# Altium schematic sheet Sheet1.SchDoc
size A3; SheetNumber: 2; SheetTotal: 2
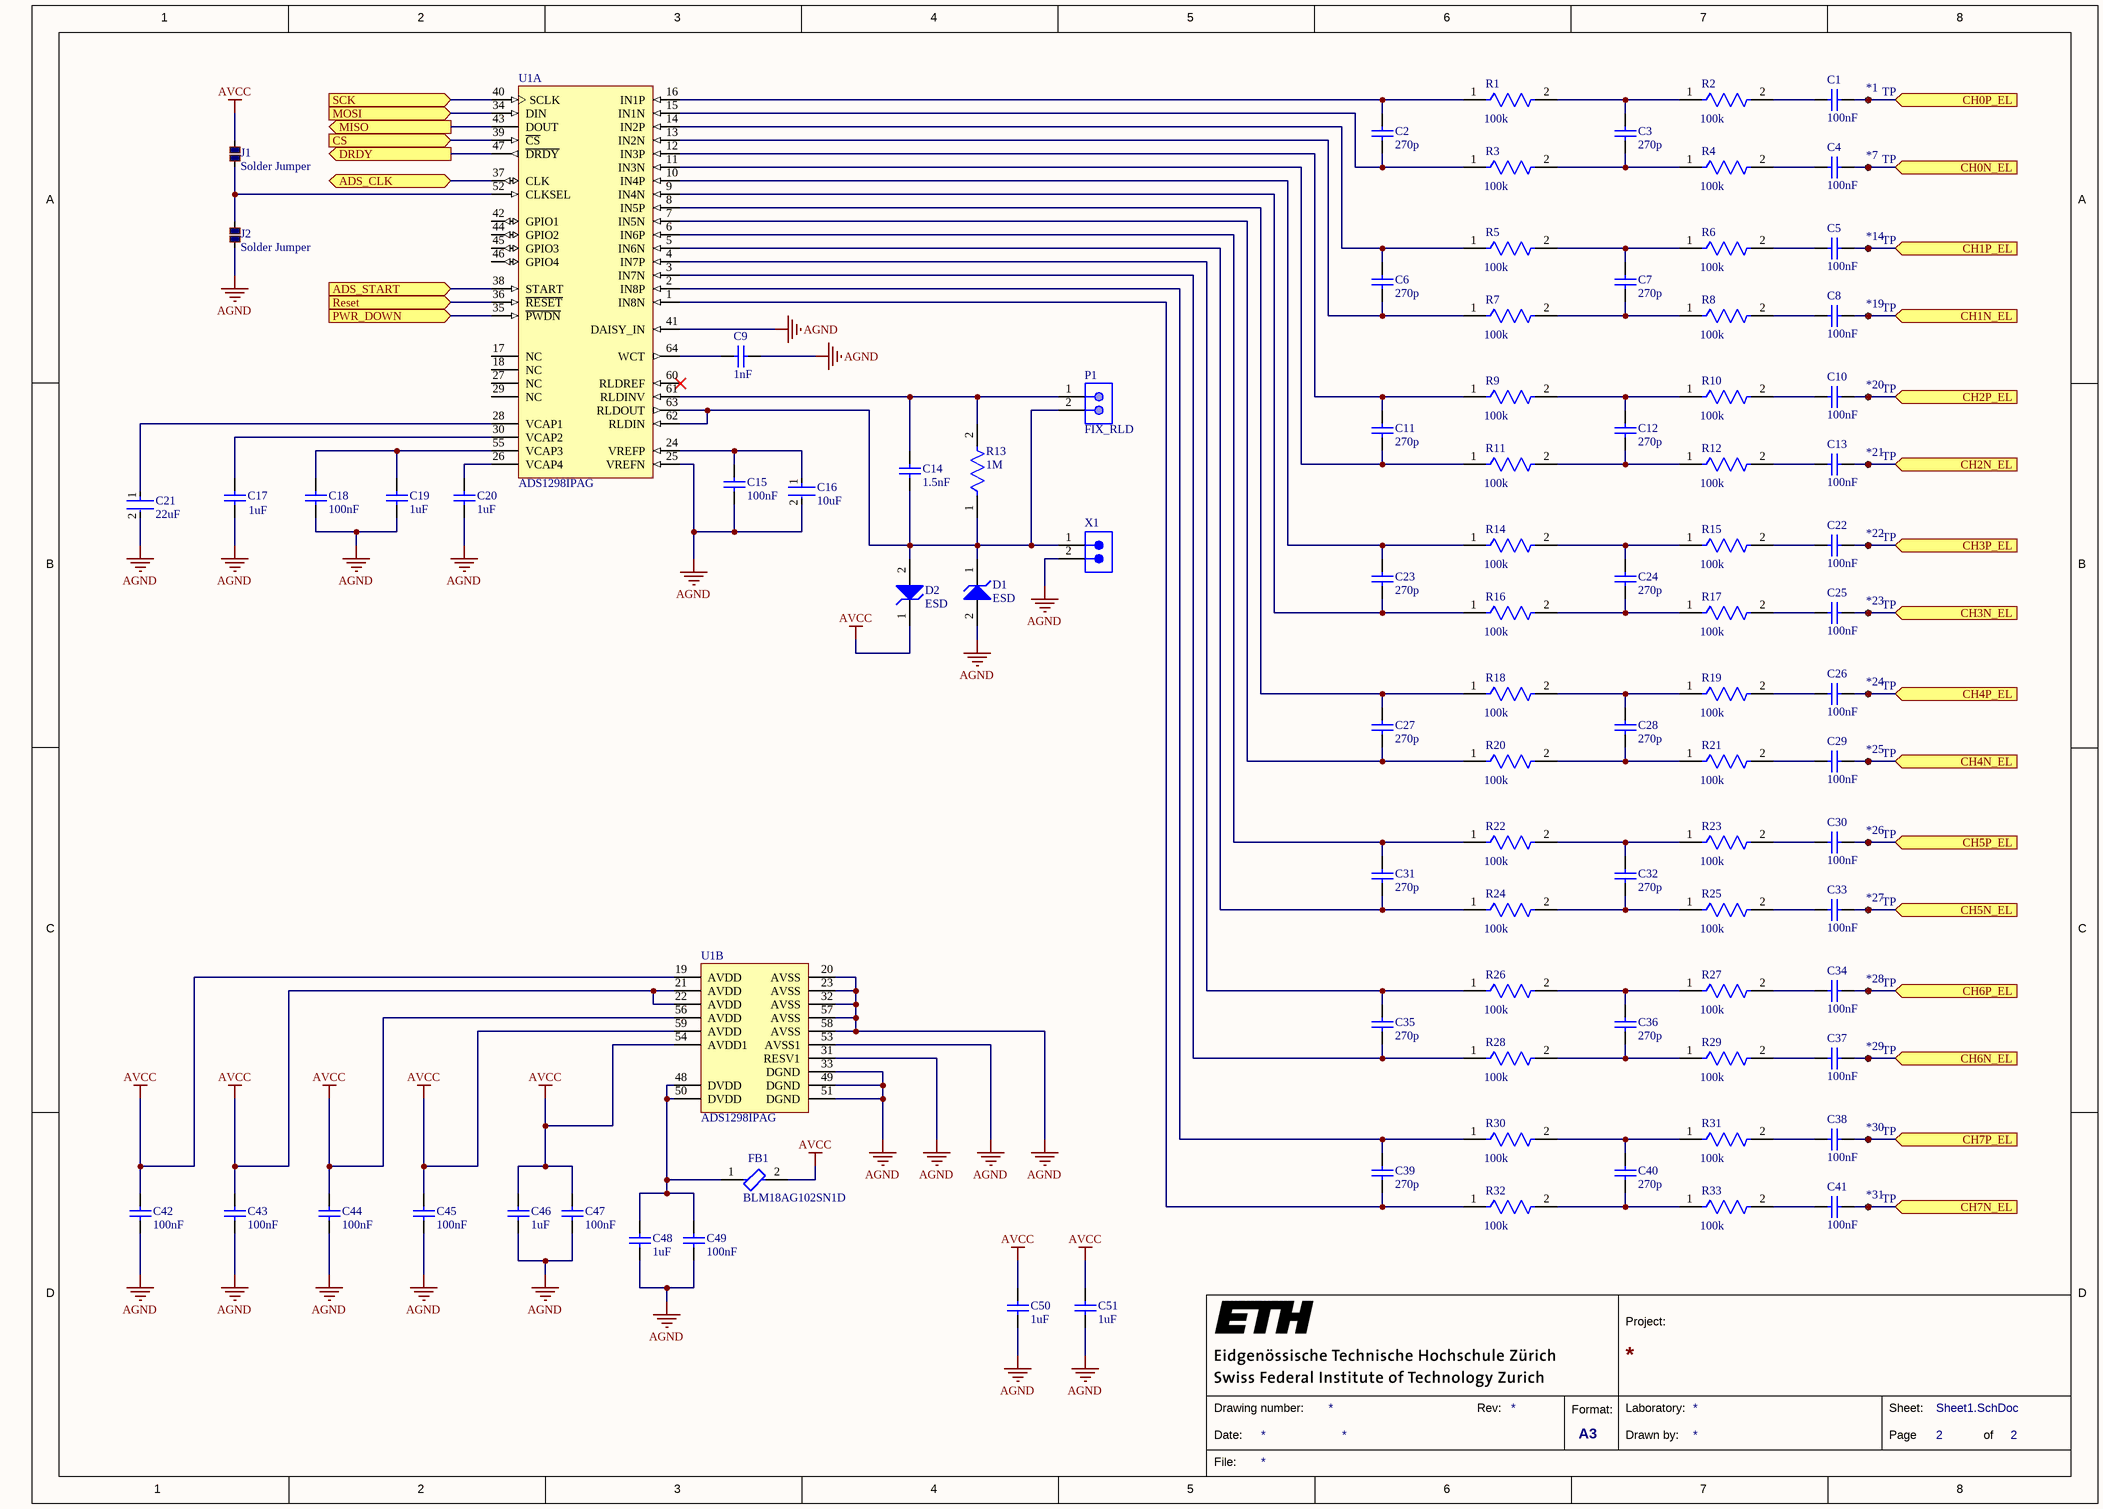
[diagram p0: Sheet1.SchDoc]

## Parts
*1  TP  [Pad-1mm]  (no BOM)
*7  TP  [Pad-1mm]  (no BOM)
*14  TP  [Pad-1mm]  (no BOM)
*19  TP  [Pad-1mm]  (no BOM)
*20  TP  [Pad-1mm]  (no BOM)
*21  TP  [Pad-1mm]  (no BOM)
*22  TP  [Pad-1mm]  (no BOM)
*23  TP  [Pad-1mm]  (no BOM)
*24  TP  [Pad-1mm]  (no BOM)
*25  TP  [Pad-1mm]  (no BOM)
*26  TP  [Pad-1mm]  (no BOM)
*27  TP  [Pad-1mm]  (no BOM)
*28  TP  [Pad-1mm]  (no BOM)
*29  TP  [Pad-1mm]  (no BOM)
*30  TP  [Pad-1mm]  (no BOM)
*31  TP  [Pad-1mm]  (no BOM)
C1  100nF  [CAPC1608X92X38LL15T08]
C2  270p  [CAPC1608X90X35NL10T15]
C3  270p  [CAPC1608X90X35NL10T15]
C4  100nF  [CAPC1608X92X38LL15T08]
C5  100nF  [CAPC1608X92X38LL15T08]
C6  270p  [CAPC1608X90X35NL10T15]
C7  270p  [CAPC1608X90X35NL10T15]
C8  100nF  [CAPC1608X92X38LL15T08]
C9  1nF  [CAPC1608X90X35LL10T15]
C10  100nF  [CAPC1608X92X38LL15T08]
C11  270p  [CAPC1608X90X35NL10T15]
C12  270p  [CAPC1608X90X35NL10T15]
C13  100nF  [CAPC1608X92X38LL15T08]
C14  1.5nF  [CAPC1608X90X35ML10T15]
C15  100nF  [CAPC1608X92X38LL15T08]
C16  10uF  [FP-GRM188-0_1-e0_2_0_55-IPC_B]
C17  1uF  [CAPC1608X95X40ML15T15]
C18  100nF  [CAPC1608X92X38LL15T08]
C19  1uF  [CAPC1608X95X40ML15T15]
C20  1uF  [CAPC1608X95X40ML15T15]
C21  22uF  [FP-CL10-IPC_A]
C22  100nF  [CAPC1608X92X38LL15T08]
C23  270p  [CAPC1608X90X35NL10T15]
C24  270p  [CAPC1608X90X35NL10T15]
C25  100nF  [CAPC1608X92X38LL15T08]
C26  100nF  [CAPC1608X92X38LL15T08]
C27  270p  [CAPC1608X90X35NL10T15]
C28  270p  [CAPC1608X90X35NL10T15]
C29  100nF  [CAPC1608X92X38LL15T08]
C30  100nF  [CAPC1608X92X38LL15T08]
C31  270p  [CAPC1608X90X35NL10T15]
C32  270p  [CAPC1608X90X35NL10T15]
C33  100nF  [CAPC1608X92X38LL15T08]
C34  100nF  [CAPC1608X92X38LL15T08]
C35  270p  [CAPC1608X90X35NL10T15]
C36  270p  [CAPC1608X90X35NL10T15]
C37  100nF  [CAPC1608X92X38LL15T08]
C38  100nF  [CAPC1608X92X38LL15T08]
C39  270p  [CAPC1608X90X35NL10T15]
C40  270p  [CAPC1608X90X35NL10T15]
C41  100nF  [CAPC1608X92X38LL15T08]
C42  100nF  [CAPC1608X92X38LL15T08]
C43  100nF  [CAPC1608X92X38LL15T08]
C44  100nF  [CAPC1608X92X38LL15T08]
C45  100nF  [CAPC1608X92X38LL15T08]
C46  1uF  [CAPC1608X95X40ML15T15]
C47  100nF  [CAPC1608X92X38LL15T08]
C48  1uF  [CAPC1608X95X40ML15T15]
C49  100nF  [CAPC1608X92X38LL15T08]
C50  1uF  [CAPC1608X95X40ML15T15]
C51  1uF  [CAPC1608X95X40ML15T15]
D1  ESD  [DFN110P160X55-2N]
D2  ESD  [DFN110P160X55-2N]
FB1  BLM18AG102SN1D  [FP-BLM18-0_15-t0_8-MFG]
J1  Solder Jumper  [Small Solder Jumper]
J2  Solder Jumper  [Small Solder Jumper]
P1  FIX_RLD  [SMTC-TSW-102-07-S-S]
R1  100k  [FP-CRCW0603-e3-IPC_C]
R2  100k  [FP-CRCW0603-e3-IPC_C]
R3  100k  [FP-CRCW0603-e3-IPC_C]
R4  100k  [FP-CRCW0603-e3-IPC_C]
R5  100k  [FP-CRCW0603-e3-IPC_C]
R6  100k  [FP-CRCW0603-e3-IPC_C]
R7  100k  [FP-CRCW0603-e3-IPC_C]
R8  100k  [FP-CRCW0603-e3-IPC_C]
R9  100k  [FP-CRCW0603-e3-IPC_C]
R10  100k  [FP-CRCW0603-e3-IPC_C]
R11  100k  [FP-CRCW0603-e3-IPC_C]
R12  100k  [FP-CRCW0603-e3-IPC_C]
R13  1M  [FP-CRCW0603-e3-MFG]
R14  100k  [FP-CRCW0603-e3-IPC_C]
R15  100k  [FP-CRCW0603-e3-IPC_C]
R16  100k  [FP-CRCW0603-e3-IPC_C]
R17  100k  [FP-CRCW0603-e3-IPC_C]
R18  100k  [FP-CRCW0603-e3-IPC_C]
R19  100k  [FP-CRCW0603-e3-IPC_C]
R20  100k  [FP-CRCW0603-e3-IPC_C]
R21  100k  [FP-CRCW0603-e3-IPC_C]
R22  100k  [FP-CRCW0603-e3-IPC_C]
R23  100k  [FP-CRCW0603-e3-IPC_C]
R24  100k  [FP-CRCW0603-e3-IPC_C]
R25  100k  [FP-CRCW0603-e3-IPC_C]
R26  100k  [FP-CRCW0603-e3-IPC_C]
R27  100k  [FP-CRCW0603-e3-IPC_C]
R28  100k  [FP-CRCW0603-e3-IPC_C]
R29  100k  [FP-CRCW0603-e3-IPC_C]
R30  100k  [FP-CRCW0603-e3-IPC_C]
R31  100k  [FP-CRCW0603-e3-IPC_C]
R32  100k  [FP-CRCW0603-e3-IPC_C]
R33  100k  [FP-CRCW0603-e3-IPC_C]
U1  ADS1298IPAG  [TI-PAG64_L]  (parts A,B of 2)
X1  43650-0213  [43650-0213]  (value not drawn)

## Ports
ADS_CLK (bidir), ADS_START (in), CH0N_EL (in), CH0P_EL (in), CH1N_EL (in), CH1P_EL (in), CH2N_EL (in), CH2P_EL (in), CH3N_EL (in), CH3P_EL (in), CH4N_EL (in), CH4P_EL (in), CH5N_EL (in), CH5P_EL (in), CH6N_EL (in), CH6P_EL (in), CH7N_EL (in), CH7P_EL (in), CS (in), DRDY (out), MISO (out), MOSI (in), PWR_DOWN (in), Reset (in), SCK (in)

## Nets
AGND: C9.1 C15.1 C16.2 C17.1 C18.2 C19.1 C20.1 C21.2 C42.1 C43.1 C44.1 C45.1 C46.1 C47.1 C48.1 C49.1 C50.1 C51.1 D1.2 J2.1 U1.20(AVSS) U1.23(AVSS) U1.25(VREFN) U1.31(RESV1) U1.32(AVSS) U1.33(DGND) U1.41(DAISY_IN) U1.49(DGND) U1.51(DGND) U1.53(AVSS1) U1.57(AVSS) U1.58(AVSS) X1.2
AVCC: C42.2 C43.2 C44.2 C45.2 C46.2 C47.2 C50.2 C51.2 D2.1 FB1.2 J1.2 U1.19(AVDD) U1.21(AVDD) U1.22(AVDD) U1.54(AVDD1) U1.56(AVDD) U1.59(AVDD)
ADS_CLK: U1.37(CLK) ; port ADS_CLK
ADS_START: U1.38(START) ; port ADS_START
CH0N_EL: *7.1 C4.1 ; port CH0N_EL
CH0P_EL: *1.1 C1.1 ; port CH0P_EL
CH1N_EL: *19.1 C8.1 ; port CH1N_EL
CH1P_EL: *14.1 C5.1 ; port CH1P_EL
CH2N_EL: *21.1 C13.1 ; port CH2N_EL
CH2P_EL: *20.1 C10.1 ; port CH2P_EL
CH3N_EL: *23.1 C25.1 ; port CH3N_EL
CH3P_EL: *22.1 C22.1 ; port CH3P_EL
CH4N_EL: *25.1 C29.1 ; port CH4N_EL
CH4P_EL: *24.1 C26.1 ; port CH4P_EL
CH5N_EL: *27.1 C33.1 ; port CH5N_EL
CH5P_EL: *26.1 C30.1 ; port CH5P_EL
CH6N_EL: *29.1 C37.1 ; port CH6N_EL
CH6P_EL: *28.1 C34.1 ; port CH6P_EL
CH7N_EL: *31.1 C41.1 ; port CH7N_EL
CH7P_EL: *30.1 C38.1 ; port CH7P_EL
CS: U1.39(~{CS}) ; port CS
DRDY: U1.47(~{DRDY}) ; port DRDY
MISO: U1.43(DOUT) ; port MISO
MOSI: U1.34(DIN) ; port MOSI
PWR_DOWN: U1.35(~{PWDN}) ; port PWR_DOWN
Reset: U1.36(~{RESET}) ; port Reset
SCK: U1.40(SCLK) ; port SCK
NetC1_2: C1.2 R2.2
NetC2_1: C2.1 R3.1 U1.15(IN1N)
NetC2_2: C2.2 R1.1 U1.16(IN1P)
NetC3_1: C3.1 R3.2 R4.1
NetC3_2: C3.2 R1.2 R2.1
NetC4_2: C4.2 R4.2
NetC5_2: C5.2 R6.2
NetC6_1: C6.1 R7.1 U1.13(IN2N)
NetC6_2: C6.2 R5.1 U1.14(IN2P)
NetC7_1: C7.1 R7.2 R8.1
NetC7_2: C7.2 R5.2 R6.1
NetC8_2: C8.2 R8.2
NetC9_2: C9.2 U1.64(WCT)
NetC10_2: C10.2 R10.2
NetC11_1: C11.1 R11.1 U1.11(IN3N)
NetC11_2: C11.2 R9.1 U1.12(IN3P)
NetC12_1: C12.1 R11.2 R12.1
NetC12_2: C12.2 R9.2 R10.1
NetC13_2: C13.2 R12.2
NetC14_1: C14.1 D1.1 D2.2 P1.2 R13.1 U1.62(RLDIN) U1.63(RLDOUT) X1.1
NetC14_2: C14.2 P1.1 R13.2 U1.61(RLDINV)
NetC15_2: C15.2 C16.1 U1.24(VREFP)
NetC17_2: C17.2 U1.30(VCAP2)
NetC18_1: C18.1 C19.2 U1.55(VCAP3)
NetC20_2: C20.2 U1.26(VCAP4)
NetC21_1: C21.1 U1.28(VCAP1)
NetC22_2: C22.2 R15.2
NetC23_1: C23.1 R16.1 U1.9(IN4N)
NetC23_2: C23.2 R14.1 U1.10(IN4P)
NetC24_1: C24.1 R16.2 R17.1
NetC24_2: C24.2 R14.2 R15.1
NetC25_2: C25.2 R17.2
NetC26_2: C26.2 R19.2
NetC27_1: C27.1 R20.1 U1.7(IN5N)
NetC27_2: C27.2 R18.1 U1.8(IN5P)
NetC28_1: C28.1 R20.2 R21.1
NetC28_2: C28.2 R18.2 R19.1
NetC29_2: C29.2 R21.2
NetC30_2: C30.2 R23.2
NetC31_1: C31.1 R24.1 U1.5(IN6N)
NetC31_2: C31.2 R22.1 U1.6(IN6P)
NetC32_1: C32.1 R24.2 R25.1
NetC32_2: C32.2 R22.2 R23.1
NetC33_2: C33.2 R25.2
NetC34_2: C34.2 R27.2
NetC35_1: C35.1 R28.1 U1.3(IN7N)
NetC35_2: C35.2 R26.1 U1.4(IN7P)
NetC36_1: C36.1 R28.2 R29.1
NetC36_2: C36.2 R26.2 R27.1
NetC37_2: C37.2 R29.2
NetC38_2: C38.2 R31.2
NetC39_1: C39.1 R32.1 U1.1(IN8N)
NetC39_2: C39.2 R30.1 U1.2(IN8P)
NetC40_1: C40.1 R32.2 R33.1
NetC40_2: C40.2 R30.2 R31.1
NetC41_2: C41.2 R33.2
NetC48_2: C48.2 C49.2 FB1.1 U1.48(DVDD) U1.50(DVDD)
NetJ1_1: J1.1 J2.2 U1.52(CLKSEL)

Not connected (* = marked no-connect by the designer): U1 17(NC) 18(NC) 27(NC) 29(NC) 42(GPIO1) 44(GPIO2) 45(GPIO3) 46(GPIO4) 60(RLDREF)*

## Notes on the sheet
- 1
- 2
- 3
- 4
- 5
- 6
- 7
- 8
- A
- B
- C
- D
- Project:
- Date:
- Drawing number:
- Rev:
- Format:
- A3
- Drawn by:
- Laboratory:
- Page
- Sheet:
- of
- File:

## Library data of the parts
*1 *7 *14 *19-*31 = CMP-01283-1: 1mm SMT Test Pad; Mounting Technology: SMT
C1 C4 C5 C8 C10 C13 C15 C18 C22 C25 C26 C29 C30 C33 C34 C37 C38 C41-C45 C47 C49 = CMP-1035-02583-2: Manufacturer: Vitramon; Part Number: VJ0603Y104JXJAC
C2 C3 C6 C7 C11 C12 C23 C24 C27 C28 C31 C32 C35 C36 C39 C40 = CMP-2006-02318-1: Manufacturer: Murata; Part Number: GCM1885C1H271JA16D
C9 = CMP-2006-02589-1: Manufacturer: Murata; Part Number: GRM1885C1E102JA01D
C14 = CMP-2006-02497-1: Manufacturer: Murata; Part Number: GRM188R72A152KA01D
C16 = CMP-2006-02787-5: Chip Multilayer Ceramic Capacitors for General Purpose, 0603, 10uF, X5R, 15%, 20%, 4V; Case/Package: 0603; Thickness: 0.035inch; Mount: Surface Mount; Capacitance: 10uF; Package Quantity: 4000; Tolerance: 20%; Depth: 0.8mm; Voltage: 4V; Height: 0.8mm; Length: 1.6mm; Packaging: Tape and Reel; Case Code (Imperial): 0603; Voltage Rating: 4V; Radiation Hardening: No; Dielectric: X5R; Max Operating Temperature: 85°C; Voltage Rating (DC): 4V; Min Operating Temperature: -55°C; Termination: SMD/SMT; Width: 0.8mm; Case Code (Metric): 1608; Lead Free: Lead Free
C17 C19 C20 C46 C48 C50 C51 = CMP-1035-02735-2: Manufacturer: Vitramon; Part Number: VJ0603V105ZXQCW1BC
C21 = CMP-13271-003053-1: Cap Ceramic 22uF 6.3V X5R ±20% Pad SMD 0603 +85°C T/R; Max Operating Temperature: 85°C; Case Code (Imperial): 0603; Packaging: Tape and Reel; Min Operating Temperature: -55°C; Voltage Rating: 6.3V; Case Code (Metric): 1608; Length: 0.063inch; Thickness: 0.041inch; Capacitance: 22uF; Tolerance: 20%; Width: 0.031inch; Mount: Surface Mount; Case/Package: 0603
D1 D2 = CMP-01186-1: TVS DIODE 5V 10.9V 2DFN; Power Line Protection: No; Number of Unidirectional Channels: 1; Peak Pulse Current: 70A; Min Operating Temperature: -40°C; Reverse Standoff Voltage: 5V; Case Code (Imperial): 0603; Case Code (Metric): 1610; Clamping Voltage: 10.9V; Packaging: Tape and Reel; Composition: Zener; Max Operating Temperature: 125°C; Case/Package: 0603; Mount: Surface Mount
FB1 = CMP-0686-00457-3: Chip Ferrite Bead, 0603, 1000Ω @ 100MHz, 0.5Ω, 25%, 450mA; Number of Circuits: 1; Max DC Current: 400mA; Shielding: Unshielded; DC Resistance (DCR): 500mR; Material: Steel; DC Resistance-Max: 700mR; Impedance: 1kR; Case Code (Imperial): 0603; Max Current Rating: 400mA; Frequency: 100MHz; Min Operating Temperature: -55°C; Case/Package: 0603; Depth: 0.8mm; Lead Free: Lead Free; Core Material: Ferrite; Current Rating: 400mA; Resistance: 500mR; Case Code (Metric): 1608; DC Current: 400mA; Package Quantity: 1; Packaging: Tape and Reel; Width: 0.8mm; Military Standard: Not; Height: 0.8mm; Series: BLM18A; Max Operating Temperature: 125°C; Tolerance: 25%; Termination: SMD/SMT; Test Frequency: 100MHz; Number of Lines: 1; Number of Pins: 2; REACH SVHC: No SVHC; Length: 1.6mm; Radiation Hardening: No
J1 J2 = CMP-00005-5: Value: 1; Technology: SMT
P1 = CMP-1681-00004-4: Male Header, Pitch 2.54 mm, 1 x 2 Position, Height 8.38 mm, Tail Length 2.54 mm, -55 to 125 degC, RoHS, Bulk; Manufacturer: Samtec; Rows: 1; ComponentLink1URL: http://www.samtec.com/; Contact Finish: Gold; Mounting Technology: Through Hole; PackageReference: TSW-102-07-S-S; RoHSCompliant: true; Pins: 2; Contact Material: Bronze; ComponentLink2Description: Datasheet; Max Operating Temperature: 125 degC; Min Operating Temperature: -55 degC; Height: 8.38 mm; Packaging: Bulk; ComponentLink1Description: Manufacturer URL; PackageDescription: Male Header, Pitch 2.54 mm, 1 x 2 Position, Height 8.38 mm, Tail Length 2.54 mm; Colour: Black; Contact Plating: Gold; Length: 5.08 mm; ComponentLink2URL: http://suddendocs.samtec.com/catalog_english/tsw_th.pdf; DatasheetVersion: 12/2015; Mount: Through Hole; Lead Pitch: 0.1 inch; REACH SVHC: No SVHC; Package Quantity: 1
R1-R12 R14-R33 = CMP-2000-03820-2: RES Thick Film, 100kΩ, 1%, 0.1W, 100ppm/°C, 0603; Power Rating: 100mW; Voltage Rating (DC): 75V; Resistance: 100kR; Width: 0.033inch; Temperature Coefficient: 100ppm/°C; Case/Package: 0603; Max Operating Temperature: 155°C; Packaging: Tape and Reel; Number of Pins: 2; Termination: SMD/SMT; Case Code (Metric): 1608; Composition: Thick Film; Radiation Hardening: No; Min Operating Temperature: -55°C; Voltage Rating: 75V; Lead Free: Lead Free; Number of Terminations: 2; Height: 0.45mm; Case Code (Imperial): 0603; Features: Automotive AEC-Q200; Length: 1.55mm; Max Power Dissipation: 100mW; Package Quantity: 10; Military Standard: Not; Tolerance: 1%; Depth: 0.85mm; Contact Plating: Tin; Weight: 7.1E-05oz
R13 = CMP-2000-03013-2: RES Thick Film, 1MΩ, 1%, 0.1W, 100ppm/°C, 0603; Max Power Dissipation: 100mW; Resistance: 1MR; Voltage Rating (DC): 75V; Depth: 0.85mm; Max Operating Temperature: 155°C; Length: 1.55mm; Power Rating: 100mW; Military Standard: Not; Features: Automotive AEC-Q200; Min Operating Temperature: -55°C; Number of Pins: 2; Mount: Surface Mount; Package Quantity: 10; Packaging: Tape and Reel; Height: 0.45mm; Radiation Hardening: No; Case Code (Metric): 1608; Temperature Coefficient: 100ppm/°C; Width: 0.85mm; Composition: Thick Film; Termination: SMD/SMT; Tolerance: 1%; Number of Terminations: 2; Lead Free: Lead Free; Contact Plating: Tin; Case/Package: 0603; Weight: 7.1E-05oz; Voltage Rating: 75V; Case Code (Imperial): 0603
U1 = CMP-0003-00595-1: 8-Channel, 24-Bit ADC with Integrated ECG Front End, -40 to 85 degC, 64-pin QFP (PAG64), Green (RoHS & no Sb/Br); Manufacturer: Texas Instruments; Analog Voltage AV/DD(Max)(V): 5.25; Digital Supply(Max)(V): 3.6; Digital Supply(Min)(V): 1.65; Sample Rate (max)(SPS): 32K; Resolution(Bits): 24; Analog Voltage AV/DD(Min)(V): 2.7; SNR(dB): 112; # Input Channels: 8; Architecture: Delta-Sigma; Interface: Serial SPI; SubFamily: Precision ADC (<=10MSPS); ComponentLink3Description: Package Specification; Code_JEDEC: MS-026; ComponentLink1Description: Manufacturer URL; ComponentLink3URL: http://www.ti.com/lit/ml/mtqf006a/mtqf006a.pdf; ComponentLink2URL: http://www.ti.com/general/docs/lit/getliterature.tsp?genericPartNumber=ADS1298&fileType=pdf; PackageVersion: 4040282/C, 11/1996; DatasheetVersion: SBAS459I; Eco-Plan: Green (RoHS & no Sb/Br); PartNumber: ADS1298IPAG; Mounting Technology: Surface Mount; ComponentLink2Description: Datasheet; PackageDescription: 64-Pin Plastic Flat Pack, Body 10 x 10 mm, Pitch 0.50 mm; ComponentLink1URL: http://www.ti.com/; PackageReference: PAG64
X1 = CMP-00813-1: Headers & Wire Housings R/A HDR SMT 2P GOLD w/Fitting Nail; Manufacturer: Molex; Number of Contacts: 2; Gender: Male; Insulation Resistance: 1GR; Current Rating: 5A; Voltage Rating: 250V; Max Current Rating: 500mA; Max Voltage Rating (AC): 50V; Pitch: 3mm; Glow Wire Compliant: Compliant; Mount: Surface Mount; Contact Plating: Nickel,Gold; Contact Material: Bronze,Brass,Tin; Housing Material: Thermoplastic; Colour: Black; Housing Colour: White; Min Operating Temperature: -40°C; Max Operating Temperature: 105°C; Termination: Solder; Number of Rows: 1; Orientation: Right Angle; Packaging: Tape and Reel; Number of Positions: 2; Package Quantity: 2880; Voltage Rating (DC): 250V; Number of Circuits: 2; Length: 13.8mm; Height: 2.27mm; Depth: 5.4mm; Lead Free: Lead Free; Flammability Rating: UL94 V-0; REACH SVHC: Unknown; Halogen Free: Low Halogen; Manufacturer Part Number: 43650-0213; Supplier: Digi-Key; Supplier Part Number: WM1895CT-ND; ComponentLink1Description: 0436500213-pcb-headers-16737124.pdf; ComponentLink1URL: https://datasheet.ciiva.com/16737/0436500213-pcb-headers-16737124.pdf; ComponentLink2Description: 1629616-6082918.pdf; ComponentLink2URL: https://datasheet.ciiva.com/6082/1629616-6082918.pdf; ComponentLink3Description: 1443567-19461270.pdf; ComponentLink3URL: https://datasheet.ciiva.com/19461/1443567-19461270.pdf; ComponentLink4Description: 62390436500213-pcb-headers-30187856.pdf; ComponentLink4URL: https://datasheet.ciiva.com/30187/62390436500213-pcb-headers-30187856.pdf; ComponentLink5Description: 0436500213-pcb-headers-168466-5150659.pdf; ComponentLink5URL: https://datasheet.ciiva.com/5150/0436500213-pcb-headers-168466-5150659.pdf; ComponentLink6Description: 0900766b80d6135b-11748820.pdf; ComponentLink6URL: https://datasheet.ciiva.com/11748/0900766b80d6135b-11748820.pdf; ComponentLink7Description: 04402316-26310746.pdf; ComponentLink7URL: https://datasheet.ciiva.com/26310/04402316-26310746.pdf; ComponentLink8Description: 1788870-46416407.pdf; ComponentLink8URL: https://datasheet.ciiva.com/46416/1788870-46416407.pdf